# EAGLE schematic ne555n-monostable (EAGLE 9.6.2)
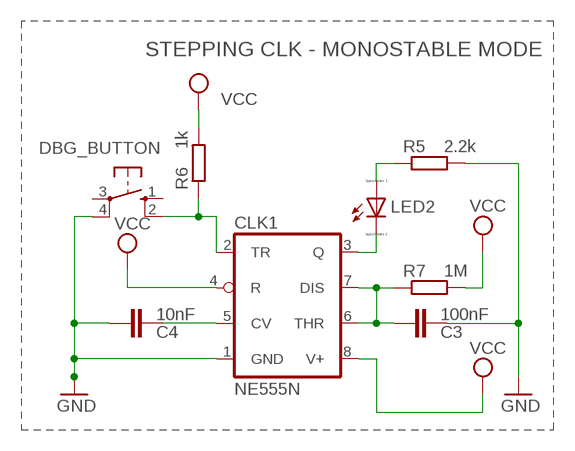
[diagram p0: schematic, sheet 1]

## Parts
C3  100nF  C-EU025-050X050  [C025-050X050]
C4  10nF  C-EU025-050X050  [C025-050X050]
CLK1  NE555N  [DIL08]
DBG_BUTTON  10-XX  [B3F-10XX]
LED2  LED_ELD260  [LED_LD260]
R5  2.2k  R-EU_0204/5  [0204/5]
R6  1k  R-EU_0204/5  [0204/5]
R7  1M  R-EU_0204/5  [0204/5]

## Nets
GND: C3.1 C4.2 CLK1.1(GND) DBG_BUTTON.4(P1) R5.2
N$1: CLK1.3(Q) LED2.K(C)
N$3: LED2.A R5.1
N$5: CLK1.2(TR) DBG_BUTTON.2(S1) R6.1
N$6: C3.2 CLK1.6(THR) CLK1.7(DIS) R7.1
N$7: C4.1 CLK1.5(CV)
VCC: CLK1.4(R) CLK1.8(V+) R6.2 R7.2
Unconnected: DBG_BUTTON.1(S) DBG_BUTTON.3(P)

## Notes on the sheet
- STEPPING CLK - MONOSTABLE MODE

## Library data of the parts
C3 C4 = resistor:C-EU: CAPACITOR, European symbol
CLK1 = linear:*555: TIMER
DBG_BUTTON = switch-omron:10-XX: OMRON SWITCH; MPN: B3F-1000; OC_FARNELL: 176432; OC_NEWARK: 36M3542
LED2 = eagle-ltspice:LED_E: LED Source: http://www.osram.convergy.de Source: www.luxeon.com Source: www.kingbright.com; SPICEMODEL: NONE; SPICEPREFIX: D; SPICETYPE: diode
R5-R7 = resistor:R-EU_: RESISTOR, European symbol